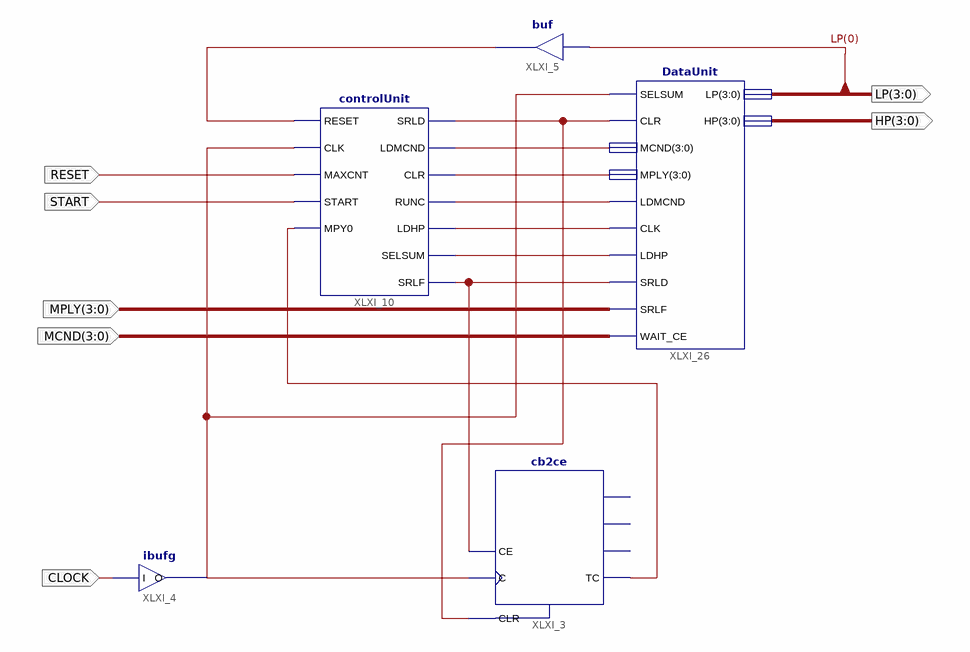
[diagram p0: schematic sheet 1]
// Xilinx ISE schematic multiplier.sch (spartan3) as structural Verilog: 5 symbols, 7 ports
module multiplier (
  input  CLOCK,
  input  RESET,
  input  START,
  input  [3:0] MCND,
  input  [3:0] MPLY,
  output [3:0] HP,
  output [3:0] LP
);

  wire XLXN_23, XLXN_28, XLXN_43, XLXN_44, XLXN_46, XLXN_47, XLXN_49, XLXN_50, XLXN_51, XLXN_70;

  controlUnit XLXI_10 (
    .CLK(XLXN_28), .CLR(XLXN_47), .LDHP(XLXN_49), .LDMCND(XLXN_46), .MAXCNT(RESET), .MPY0(XLXN_43),
    .RESET(XLXN_23), .RUNC(XLXN_70), .SELSUM(XLXN_50), .SRLD(XLXN_51), .SRLF(XLXN_44), .START(START));
  cb2ce XLXI_3 (.C(XLXN_28), .CE(XLXN_44), .CLR(XLXN_51), .TC(XLXN_43));  // open: CEO, Q0, Q1
  ibufg XLXI_4 (.I(CLOCK), .O(XLXN_28));
  buf XLXI_5 (XLXN_23, LP[0]);
  DataUnit XLXI_26 (
    .CLK(XLXN_49), .CLR(XLXN_51), .HP(HP), .LDHP(XLXN_50), .LDMCND(XLXN_70), .LP(LP), .MCND({4{XLXN_46}}),
    .MPLY({4{XLXN_47}}), .SELSUM(XLXN_28), .SRLD(XLXN_44), .SRLF(MPLY), .WAIT_CE(MCND));
endmodule
